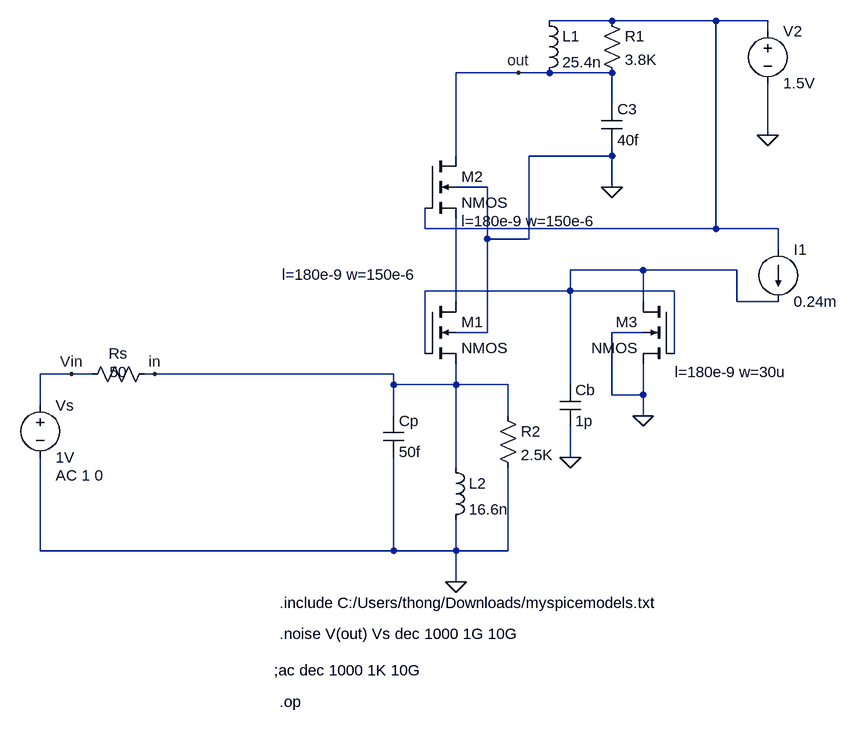
[diagram p0: schematic CG_LNA _withoutro.asc]
CG_LNA _withoutro.asc, the LTspice schematic file:
Version 4
SHEET 1 880 680
WIRE 448 -416 352 -416
WIRE 608 -416 448 -416
WIRE 688 -416 608 -416
WIRE 688 -400 688 -416
WIRE 304 -336 208 -336
WIRE 352 -336 304 -336
WIRE 448 -336 352 -336
WIRE 448 -288 448 -336
WIRE 688 -240 688 -320
WIRE 208 -208 208 -336
WIRE 448 -208 448 -224
WIRE 448 -208 320 -208
WIRE 256 -160 208 -160
WIRE 448 -160 448 -208
WIRE 160 -96 160 -128
WIRE 608 -96 608 -416
WIRE 608 -96 160 -96
WIRE 704 -96 608 -96
WIRE 256 -80 256 -160
WIRE 320 -80 320 -208
WIRE 320 -80 256 -80
WIRE 704 -64 704 -96
WIRE 496 -32 384 -32
WIRE 640 -32 496 -32
WIRE 384 0 384 -32
WIRE 384 0 160 0
WIRE 544 0 384 0
WIRE 208 16 208 -112
WIRE 496 16 496 -32
WIRE 640 16 640 -32
WIRE 704 16 640 16
WIRE 256 64 256 -80
WIRE 256 64 208 64
WIRE 496 64 448 64
WIRE 160 96 160 0
WIRE 544 96 544 0
WIRE -384 128 -432 128
WIRE -352 128 -384 128
WIRE -256 128 -272 128
WIRE 112 128 -256 128
WIRE 112 144 112 128
WIRE 208 144 208 112
WIRE 208 144 112 144
WIRE 288 144 208 144
WIRE 384 144 384 0
WIRE 448 160 448 64
WIRE 496 160 496 112
WIRE 496 160 448 160
WIRE -432 176 -432 128
WIRE 112 192 112 144
WIRE 288 192 288 144
WIRE 496 192 496 160
WIRE 384 256 384 208
WIRE 208 272 208 144
WIRE -432 400 -432 256
WIRE 112 400 112 256
WIRE 112 400 -432 400
WIRE 208 400 208 352
WIRE 208 400 112 400
WIRE 288 400 288 272
WIRE 288 400 208 400
WIRE 208 448 208 400
FLAG 496 192 0
FLAG 384 256 0
FLAG 688 -240 0
FLAG 448 -160 0
FLAG 304 -336 out
FLAG -384 128 Vin
FLAG 208 448 0
FLAG -256 128 in
SYMBOL res -256 112 R90
WINDOW 0 0 56 VBottom 2
WINDOW 3 28 56 VBottom 2
SYMATTR InstName Rs
SYMATTR Value 50
SYMBOL ind 192 256 R0
SYMATTR InstName L2
SYMATTR Value 16.6n
SYMBOL nmos4 160 16 R0
WINDOW 123 -220 -41 Left 2
SYMATTR Value2 l=180e-9 w=150e-6
SYMATTR InstName M1
SYMBOL ind 336 -432 R0
SYMATTR InstName L1
SYMATTR Value 25.4n
SYMBOL res 432 -432 R0
SYMATTR InstName R1
SYMATTR Value 3.8K
SYMBOL cap 368 144 R0
SYMATTR InstName Cb
SYMATTR Value 1p
SYMBOL voltage 688 -416 R0
WINDOW 123 0 0 Left 0
WINDOW 39 0 0 Left 0
SYMATTR InstName V2
SYMATTR Value 1.5V
SYMBOL nmos4 160 -208 R0
WINDOW 123 56 100 Left 2
SYMATTR Value2 l=180e-9 w=150e-6
SYMATTR InstName M2
SYMBOL nmos4 544 16 M0
WINDOW 123 -175 109 Left 2
SYMATTR Value2 l=180e-9 w=30u
SYMATTR InstName M3
SYMBOL cap 96 192 R0
SYMATTR InstName Cp
SYMATTR Value 50f
SYMBOL voltage -432 160 R0
WINDOW 123 24 124 Left 2
WINDOW 39 0 0 Left 0
SYMATTR Value2 AC 1 0
SYMATTR InstName Vs
SYMATTR Value 1V
SYMBOL cap 432 -288 R0
SYMATTR InstName C3
SYMATTR Value 40f
SYMBOL current 704 -64 R0
WINDOW 123 0 0 Left 0
WINDOW 39 0 0 Left 0
SYMATTR InstName I1
SYMATTR Value 0.24m
SYMBOL res 272 176 R0
SYMATTR InstName R2
SYMATTR Value 2.5K
TEXT -64 480 Left 2 !.include C:/Users/thong/Downloads/myspicemodels.txt
TEXT -64 632 Left 2 !.op
TEXT -72 584 Left 2 !;ac dec 1000 1K 10G
TEXT -64 528 Left 2 !.noise V(out) Vs dec 1000 1G 10G

The netlist it stands for:
* CG_LNA _withoutro.asc
Rs in Vin 50
L2 in 0 16.6n
M1 N003 N002 in 0 NMOS l=180e-9 w=150e-6
L1 N001 out 25.4n
R1 N001 out 3.8K
Cb N002 0 1p
V2 N001 0 1.5V
M2 out N001 N003 0 NMOS l=180e-9 w=150e-6
M3 N002 N002 0 0 NMOS l=180e-9 w=30u
Cp in 0 50f
Vs Vin 0 1V AC 1 0
C3 out 0 40f
I1 N001 N002 0.24m
R2 in 0 2.5K
.model NMOS NMOS
.model PMOS PMOS
.lib standard.mos
.include C:/Users/thong/Downloads/myspicemodels.txt
.op
;ac dec 1000 1K 10G
.noise V(out) Vs dec 1000 1G 10G
.backanno
.end